# Altium schematic sheet diff_amp.SchDoc
size A
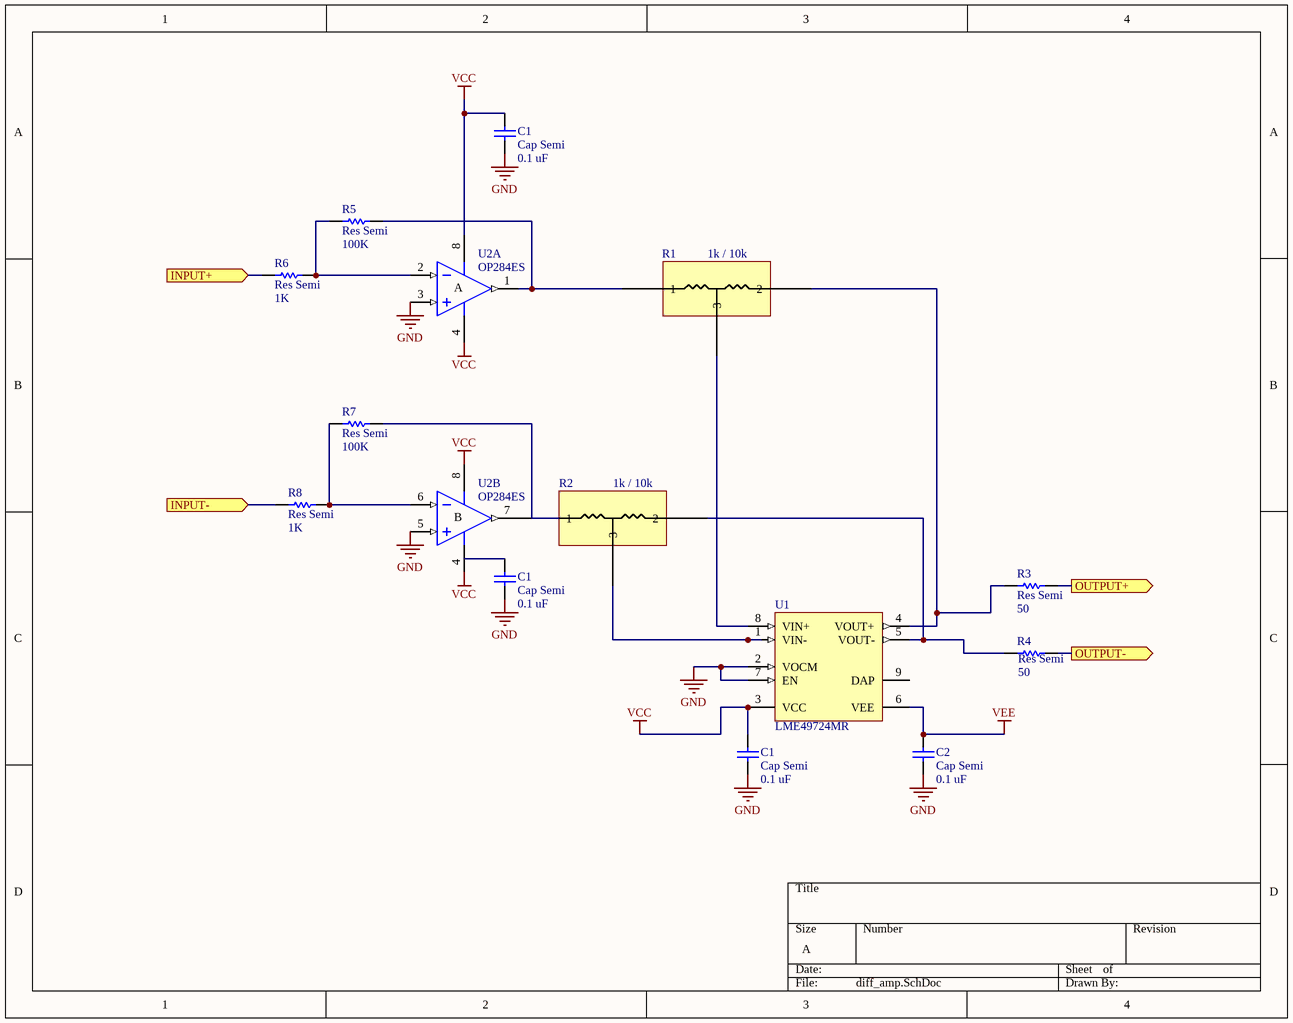
[diagram p0: diff_amp.SchDoc]

## Parts
(Parts that share a designator on the sheet are numbered #1, #2 ... from top to bottom, then left to right.)
C1#1  Cap Semi  value 0.1 uF  [CAPC1608L]
C1#2  Cap Semi  value 0.1 uF  [CAPC1608L]
C1#3  Cap Semi  value 0.1 uF  [CAPC1608L]
C2  Cap Semi  value 0.1 uF  [CAPC1608L]
R1  1k / 10k  [SOT23-3L]
R2  1k / 10k  [SOT23-3L]
R3  Res Semi  value 50  [RESC1608L]
R4  Res Semi  value 50  [RESC1608L]
R5  Res Semi  value 100K  [RESC1608L]
R6  Res Semi  value 1K  [RESC1608L]
R7  Res Semi  value 100K  [RESC1608L]
R8  Res Semi  value 1K  [RESC1608L]
U1  LME49724MR  [MRA08B_M]
U2  OP284ES  [SO-8_M]  (parts A,B of 2)

## Ports
INPUT+ (in), INPUT- (in), OUTPUT+ (out), OUTPUT- (out)

## Nets
GND: C1#1.1 C1#2.1 C1#3.1 C2.1 U1.2(VOCM) U1.7(EN) U2.3(IN+) U2.5(IN+)
VCC: C1#1.2 C1#3.2 U1.3(VCC) U2.4(V-) U2.8(V+)
VEE: C2.2 U1.6(VEE)
INPUT+: R6.1 ; port INPUT+
INPUT-: R8.1 ; port INPUT-
OUTPUT+: R3.2 ; port OUTPUT+
OUTPUT-: R4.2 ; port OUTPUT-
NetR1_0: R1.0(1) R5.2 U2.1(OUT)
NetR1_1: R1.1(2) R3.1 U1.4(VOUT+)
NetR1_2: R1.2(3) U1.8(VIN+)
NetR2_0: R2.0(1) U2.7(OUT)
NetR2_1: R2.1(2) R4.1 U1.5(VOUT-)
NetR2_2: R2.2(3) U1.1(VIN-)
NetR5_1: R5.1 R6.2 U2.2(IN-)
NetR7_1: R7.1 R8.2 U2.6(IN-)

Not connected (* = marked no-connect by the designer): C1#2 2; R7 2; U1 9(DAP)

## Notes on the sheet
- (in symbol OP284ES, part A) A
- (in symbol OP284ES, part B) B

## Library data of the parts
C1#1-C1#3 C2 = Cap Semi: Capacitor (Semiconductor SIM Model); Published: 8-Jun-2000; LatestRevisionDate: 29-May-2009; LatestRevisionNote: IPC-7351 Footprint Added.; PackageReference: C1206; Publisher: Altium Limited; PackageDescription: Chip Capacitor
R1 R2 = resistor_divider: Precision Resistor Divider; pin to pad: 0>1 1>2 2>3
R3-R8 = Res Semi: Semiconductor Resistor; Published: 8-Jun-2000; LatestRevisionDate: 17-Jul-2002; LatestRevisionNote: Re-released for DXP Platform.; PackageReference: AXIAL-0.5; Publisher: Altium Limited
U1 = LME49724MR: High Performance, High Fidelity, Fully-Differential Audio Operational Amplifier; Manufacturer: National Semiconductor; CompType: Audio IC; PackageTopMarking: NSXYTT*L49724*MR; PowerWise: N; Published: 29-May-2009; DatasheetVersion: Nov-2008; PackageVersion: revB, Dec-2007; PackageReference: MRA08B; Publisher: Altium Limited; PackageDescription: Molded, PSOP .193 x .154 x .058in, 8 Lead, .050in Pitch, Large DAP; PartNumber: LME49724MR; RoHS: Y; PinCount: 8; DigiKeyPartNumber: LME49724MR-ND; Code_JEDEC: MS-012-AA; ComponentLink1Description: LME49724 Datasheet; ComponentLink1URL: http://www.national.com/ds/LM/LME49724.pdf; ComponentLink2Description: LME49724 Web Page; ComponentLink2URL: http://www.national.com/pf/LM/LME49724.html; ComponentLink3Description: MRA08B Package Page; ComponentLink3URL: http://www.national.com/packaging/folders/mra08b.html
U2 = OP284ES: Precision Rail-to-Rail Input and Output Operational Amplifier; Published: 8-Jun-2000; LatestRevisionDate: 13-Apr-2006; LatestRevisionNote: IPC-7351 Footprint Added.; DatasheetVersion: REV. 0 1996; PackageVersion: revA; PackageReference: SO-8; Publisher: Altium Limited; PackageDescription: 8-Pin Small Outline Integrated Circuit 1.27 mm Pitch; Code_JEDEC: MS-012-AA; Code_IPC: SOIC127P600-8; ComponentLink1Description: Manufacturer Link; ComponentLink1URL: http://www.analog.com/en/prod/0,,759_786_OP184%2C00.html; ComponentLink2Description: Datasheet; ComponentLink2URL: http://www.analog.com/UploadedFiles/Data_Sheets/390492658OP184_284_484_b.pdf; ComponentLink3Description: Discontinuation Notice; ComponentLink3URL: http://www.analog.com/UploadedFiles/Aerospace_Information/505817548385948813507767505obsolete.pdf